# Altium schematic sheet RELAY_X4_IMO3GR.SchDoc: Power Control or PWM
size A4; DocumentNumber: 15; Revision: 5; SheetNumber: 16; SheetTotal: 77; Organization: Altium Limited.; Address1: Level 3, 12a Rodborough Rd; Address2: Frenchs Forest 2086; Address3: NSW; Address4: AUSTRALIA
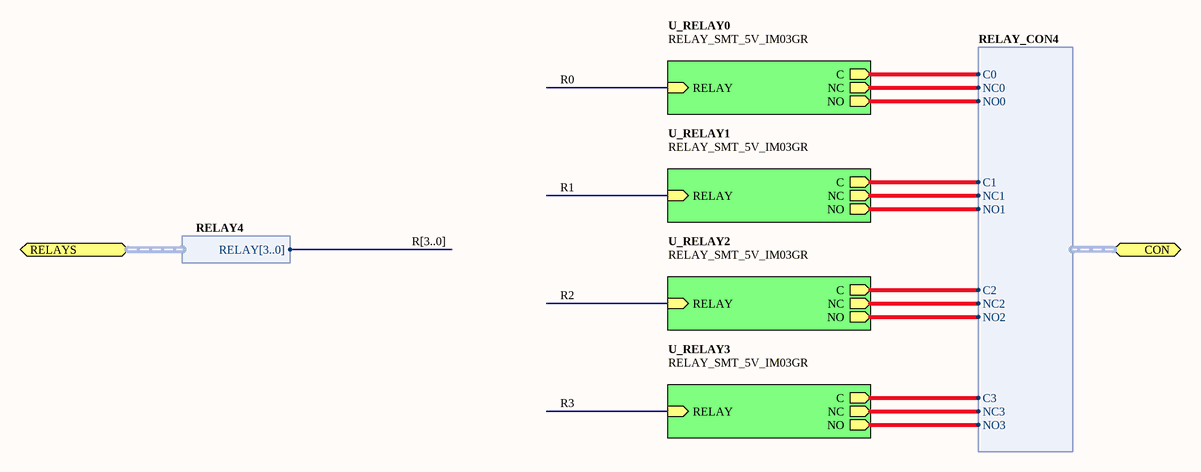
[diagram p0: RELAY_X4_IMO3GR.SchDoc]

## Sub-sheets
U_RELAY0 = RELAY_SMT_5V_IM03GR: RELAY (in), NO (out), C (out), NC (out)
U_RELAY1 = RELAY_SMT_5V_IM03GR: RELAY (in), NO (out), C (out), NC (out)
U_RELAY2 = RELAY_SMT_5V_IM03GR: RELAY (in), NO (out), C (out), NC (out)
U_RELAY3 = RELAY_SMT_5V_IM03GR: RELAY (in), NO (out), C (out), NC (out)

## Ports
CON (harness RELAY_CON4), RELAYS (harness RELAY4)

## Harnesses
RELAY_CON4: NO0, C0, NC0, NO1, C1, NC1, NO2, C2, NC2, NO3, C3, NC3
RELAY4: RELAY[3..0]

## Nets
R0: sheet U_RELAY0/RELAY
R1: sheet U_RELAY1/RELAY
R2: sheet U_RELAY2/RELAY
R3: sheet U_RELAY3/RELAY
(unnamed): sheet U_RELAY0/NO, port CON.NO0
(unnamed): sheet U_RELAY0/C, port CON.C0
(unnamed): sheet U_RELAY0/NC, port CON.NC0
(unnamed): sheet U_RELAY1/NO, port CON.NO1
(unnamed): sheet U_RELAY1/C, port CON.C1
(unnamed): sheet U_RELAY1/NC, port CON.NC1
(unnamed): sheet U_RELAY2/NO, port CON.NO2
(unnamed): sheet U_RELAY2/C, port CON.C2
(unnamed): sheet U_RELAY2/NC, port CON.NC2
(unnamed): sheet U_RELAY3/NO, port CON.NO3
(unnamed): sheet U_RELAY3/C, port CON.C3
(unnamed): sheet U_RELAY3/NC, port CON.NC3

## Buses and harness runs
bus R[3..0]

## Notes on the sheet
- Sheet Title
- Project Title
- Size:
- Date:
- A4
- Assy:
- Time:
- Revision:
- Sheet
- of
- File: